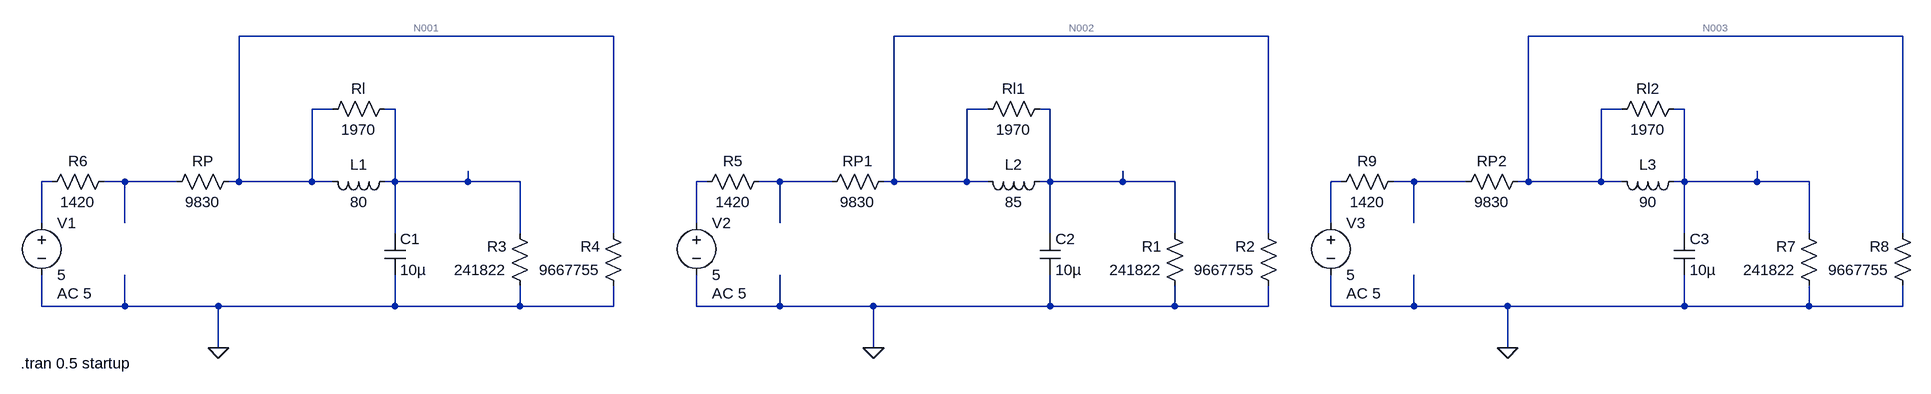
[diagram p0: schematic mediciones cap_seslab.asc]
mediciones cap_seslab.asc, the LTspice schematic file:
Version 4
SHEET 1 2788 680
WIRE 784 -128 208 -128
WIRE 1792 -128 1216 -128
WIRE 2768 -128 2192 -128
WIRE 352 -16 320 -16
WIRE 448 -16 432 -16
WIRE 1360 -16 1328 -16
WIRE 1456 -16 1440 -16
WIRE 2336 -16 2304 -16
WIRE 2432 -16 2416 -16
WIRE -80 96 -96 96
WIRE 32 96 0 96
WIRE 112 96 32 96
WIRE 208 96 208 -128
WIRE 208 96 192 96
WIRE 320 96 320 -16
WIRE 320 96 208 96
WIRE 352 96 320 96
WIRE 448 96 448 -16
WIRE 448 96 432 96
WIRE 560 96 560 80
WIRE 560 96 448 96
WIRE 640 96 560 96
WIRE 928 96 912 96
WIRE 1040 96 1008 96
WIRE 1120 96 1040 96
WIRE 1216 96 1216 -128
WIRE 1216 96 1200 96
WIRE 1328 96 1328 -16
WIRE 1328 96 1216 96
WIRE 1360 96 1328 96
WIRE 1456 96 1456 -16
WIRE 1456 96 1440 96
WIRE 1568 96 1568 80
WIRE 1568 96 1456 96
WIRE 1648 96 1568 96
WIRE 1904 96 1888 96
WIRE 2016 96 1984 96
WIRE 2096 96 2016 96
WIRE 2192 96 2192 -128
WIRE 2192 96 2176 96
WIRE 2304 96 2304 -16
WIRE 2304 96 2192 96
WIRE 2336 96 2304 96
WIRE 2432 96 2432 -16
WIRE 2432 96 2416 96
WIRE 2544 96 2544 80
WIRE 2544 96 2432 96
WIRE 2624 96 2544 96
WIRE -96 160 -96 96
WIRE 32 160 32 96
WIRE 912 160 912 96
WIRE 1040 160 1040 96
WIRE 1888 160 1888 96
WIRE 2016 160 2016 96
WIRE 448 176 448 96
WIRE 640 176 640 96
WIRE 784 176 784 -128
WIRE 1456 176 1456 96
WIRE 1648 176 1648 96
WIRE 1792 176 1792 -128
WIRE 2432 176 2432 96
WIRE 2624 176 2624 96
WIRE 2768 176 2768 -128
WIRE -96 288 -96 240
WIRE 32 288 32 240
WIRE 32 288 -96 288
WIRE 176 288 32 288
WIRE 448 288 448 240
WIRE 448 288 176 288
WIRE 640 288 640 256
WIRE 640 288 448 288
WIRE 784 288 784 256
WIRE 784 288 640 288
WIRE 912 288 912 240
WIRE 1040 288 1040 240
WIRE 1040 288 912 288
WIRE 1184 288 1040 288
WIRE 1456 288 1456 240
WIRE 1456 288 1184 288
WIRE 1648 288 1648 256
WIRE 1648 288 1456 288
WIRE 1792 288 1792 256
WIRE 1792 288 1648 288
WIRE 1888 288 1888 240
WIRE 2016 288 2016 240
WIRE 2016 288 1888 288
WIRE 2160 288 2016 288
WIRE 2432 288 2432 240
WIRE 2432 288 2160 288
WIRE 2624 288 2624 256
WIRE 2624 288 2432 288
WIRE 2768 288 2768 256
WIRE 2768 288 2624 288
WIRE 176 352 176 288
WIRE 1184 352 1184 288
WIRE 2160 352 2160 288
FLAG 176 352 0
FLAG 1184 352 0
FLAG 2160 352 0
SYMBOL res 208 80 R90
WINDOW 0 0 56 VBottom 2
WINDOW 3 32 56 VTop 2
SYMATTR InstName RP
SYMATTR Value 9830
SYMBOL res 656 272 R180
WINDOW 0 36 76 Left 2
WINDOW 3 36 40 Left 2
SYMATTR InstName R3
SYMATTR Value 241822
SYMBOL res 800 272 R180
WINDOW 0 36 76 Left 2
WINDOW 3 36 40 Left 2
SYMATTR InstName R4
SYMATTR Value 9667755
SYMBOL cap 432 176 R0
SYMATTR InstName C1
SYMATTR Value 10µ
SYMBOL ind 448 80 R90
WINDOW 0 5 56 VBottom 2
WINDOW 3 32 56 VTop 2
SYMATTR InstName L1
SYMATTR Value 80
SYMBOL res 448 -32 R90
WINDOW 0 0 56 VBottom 2
WINDOW 3 32 56 VTop 2
SYMATTR InstName Rl
SYMATTR Value 1970
SYMBOL res 16 80 R90
WINDOW 0 0 56 VBottom 2
WINDOW 3 32 56 VTop 2
SYMATTR InstName R6
SYMATTR Value 1420
SYMBOL voltage -96 144 R0
WINDOW 123 24 124 Left 2
WINDOW 39 0 0 Left 2
SYMATTR Value2 AC 5
SYMATTR InstName V1
SYMATTR Value 5
SYMBOL res 1216 80 R90
WINDOW 0 0 56 VBottom 2
WINDOW 3 32 56 VTop 2
SYMATTR InstName RP1
SYMATTR Value 9830
SYMBOL res 1664 272 R180
WINDOW 0 36 76 Left 2
WINDOW 3 36 40 Left 2
SYMATTR InstName R1
SYMATTR Value 241822
SYMBOL res 1808 272 R180
WINDOW 0 36 76 Left 2
WINDOW 3 36 40 Left 2
SYMATTR InstName R2
SYMATTR Value 9667755
SYMBOL cap 1440 176 R0
SYMATTR InstName C2
SYMATTR Value 10µ
SYMBOL ind 1456 80 R90
WINDOW 0 5 56 VBottom 2
WINDOW 3 32 56 VTop 2
SYMATTR InstName L2
SYMATTR Value 85
SYMBOL res 1456 -32 R90
WINDOW 0 0 56 VBottom 2
WINDOW 3 32 56 VTop 2
SYMATTR InstName Rl1
SYMATTR Value 1970
SYMBOL res 1024 80 R90
WINDOW 0 0 56 VBottom 2
WINDOW 3 32 56 VTop 2
SYMATTR InstName R5
SYMATTR Value 1420
SYMBOL voltage 912 144 R0
WINDOW 123 24 124 Left 2
WINDOW 39 0 0 Left 2
SYMATTR Value2 AC 5
SYMATTR InstName V2
SYMATTR Value 5
SYMBOL res 2192 80 R90
WINDOW 0 0 56 VBottom 2
WINDOW 3 32 56 VTop 2
SYMATTR InstName RP2
SYMATTR Value 9830
SYMBOL res 2640 272 R180
WINDOW 0 36 76 Left 2
WINDOW 3 36 40 Left 2
SYMATTR InstName R7
SYMATTR Value 241822
SYMBOL res 2784 272 R180
WINDOW 0 36 76 Left 2
WINDOW 3 36 40 Left 2
SYMATTR InstName R8
SYMATTR Value 9667755
SYMBOL cap 2416 176 R0
SYMATTR InstName C3
SYMATTR Value 10µ
SYMBOL ind 2432 80 R90
WINDOW 0 5 56 VBottom 2
WINDOW 3 32 56 VTop 2
SYMATTR InstName L3
SYMATTR Value 90
SYMBOL res 2432 -32 R90
WINDOW 0 0 56 VBottom 2
WINDOW 3 32 56 VTop 2
SYMATTR InstName Rl2
SYMATTR Value 1970
SYMBOL res 2000 80 R90
WINDOW 0 0 56 VBottom 2
WINDOW 3 32 56 VTop 2
SYMATTR InstName R9
SYMATTR Value 1420
SYMBOL voltage 1888 144 R0
WINDOW 123 24 124 Left 2
WINDOW 39 0 0 Left 2
SYMATTR Value2 AC 5
SYMATTR InstName V3
SYMATTR Value 5
TEXT -128 376 Left 2 !.tran 0.5 startup

The netlist it stands for:
* mediciones cap_seslab.asc
RP N001 N008 9830
R3 0 N004 241822
R4 0 N001 9667755
C1 N004 0 10µ
L1 N004 N001 80
Rl N004 N001 1970
R6 N008 N007 1420
V1 N007 0 5 AC 5
RP1 N002 N010 9830
R1 0 N005 241822
R2 0 N002 9667755
C2 N005 0 10µ
L2 N005 N002 85
Rl1 N005 N002 1970
R5 N010 N009 1420
V2 N009 0 5 AC 5
RP2 N003 N012 9830
R7 0 N006 241822
R8 0 N003 9667755
C3 N006 0 10µ
L3 N006 N003 90
Rl2 N006 N003 1970
R9 N012 N011 1420
V3 N011 0 5 AC 5
.tran 0.5 startup
.backanno
.end

* Results of the author's LTspice run, read from the files saved beside the schematic
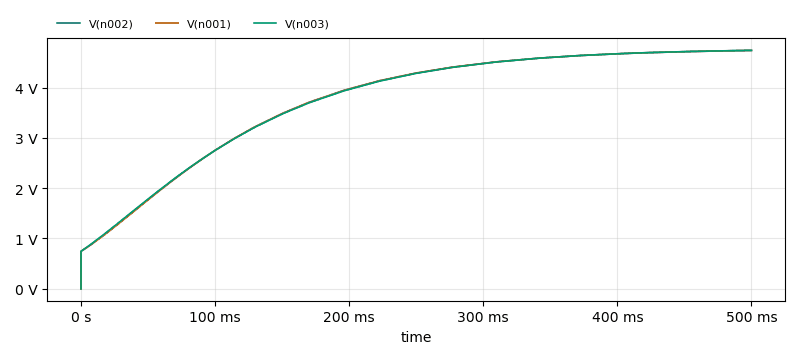
[diagram p1: Transient Analysis of mediciones cap_seslab.asc, plotted from the saved traces]
* Transient Analysis, 1 run:
*   V(n002): min 0 V, max 4.738 V, average 3.752 V, rms 3.921 V, last 4.738 V
*   V(n001): min 0 V, max 4.737 V, average 3.753 V, rms 3.922 V, last 4.737 V
*   V(n003): min 0 V, max 4.738 V, average 3.752 V, rms 3.92 V, last 4.738 V